# EAGLE design TheSiS (EAGLE 9.6.2)
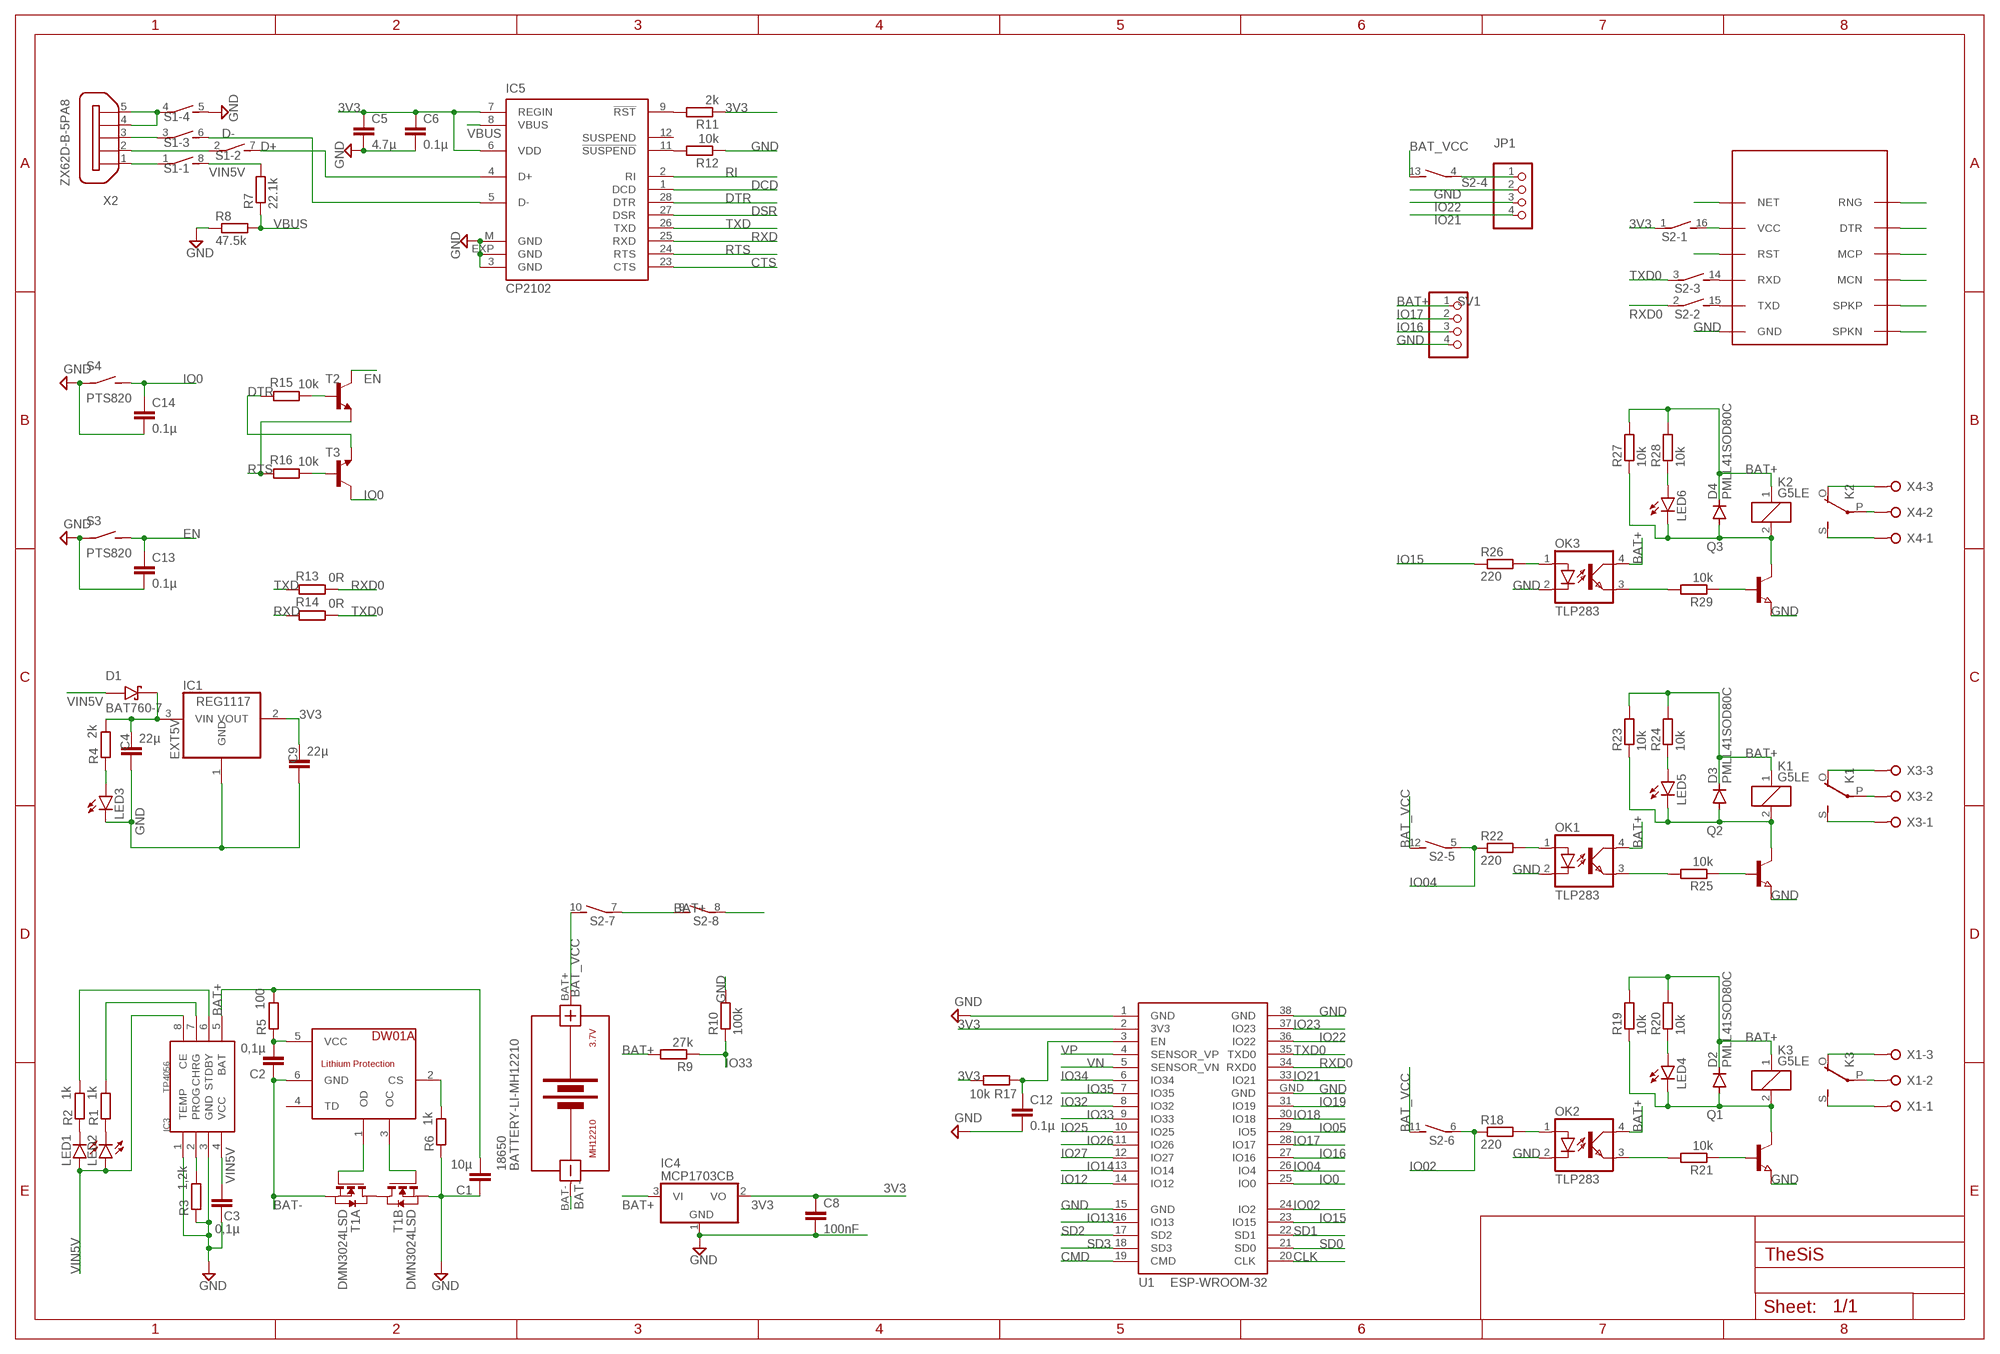
[diagram p0: schematic, sheet 1]

## Parts
18650  BATTERY-LI-MH12210  [BATTERY-LI-MH12210]
C1  10µ  C-EUC0603  [C0603]
C2  0,1µ  C-EUC0805  [C0805]
C3  0,1µ  C-EUC0805K  [C0805K]
C4  22µ  C-EUC0805  [C0805]
C5  4.7µ  C-EUC0805  [C0805]
C6  0.1µ  C-EUC0805  [C0805]
C8  100nF  C-EUC0805  [C0805]
C9  22µ  C-EUC0805  [C0805]
C12  0.1µ  C-EUC0805  [C0805]
C13  0.1µ  C-EUC0805  [C0805]
C14  0.1µ  C-EUC0805  [C0805]
D1  BAT760-7  [SOD2513X120N]
D2  PMLL41SOD80C  [SOD80C]
D3  PMLL41SOD80C  [SOD80C]
D4  PMLL41SOD80C  [SOD80C]
IC1  REG1117  [SOT223A]
IC3  TP4056  [SOP-8]
IC4  MCP1703CB  [SOT23]
IC5  CP2102  [QFN28]
JP1  PINHD-1X4  [1X04]
K1  G5LE  [G5LE]
K2  G5LE  [G5LE]
K3  G5LE  [G5LE]
LED1  LEDCHIP-LED0805  [CHIP-LED0805]
LED2  LEDCHIP-LED0805  [CHIP-LED0805]
LED3  LEDCHIP-LED0805  [CHIP-LED0805]
LED4  LEDCHIP-LED0805  [CHIP-LED0805]
LED5  LEDCHIP-LED0805  [CHIP-LED0805]
LED6  LEDCHIP-LED0805  [CHIP-LED0805]
OK1  TLP283  [SOT23-4]
OK2  TLP283  [SOT23-4]
OK3  TLP283  [SOT23-4]
Q1  NPN-TRANSISTOR_SOT23  [SOT23]
Q2  NPN-TRANSISTOR_SOT23  [SOT23]
Q3  NPN-TRANSISTOR_SOT23  [SOT23]
R1  1k  R-EU_R0603  [R0603]
R2  1k  R-EU_R0603  [R0603]
R3  1,2k  R-EU_R0603  [R0603]
R4  2k  R-EU_R0805  [R0805]
R5  100  R-EU_R0603  [R0603]
R6  1k  R-EU_R0603  [R0603]
R7  22.1k  R-EU_R0805  [R0805]
R8  47.5k  R-EU_R0805  [R0805]
R9  27k  R-EU_R0805  [R0805]
R10  100k  R-EU_R0805  [R0805]
R11  2k  R-EU_R0805  [R0805]
R12  10k  R-EU_R0805  [R0805]
R13  0R  R-EU_R0805  [R0805]
R14  0R  R-EU_R0805  [R0805]
R15  10k  R-EU_R0805  [R0805]
R16  10k  R-EU_R0805  [R0805]
R17  10k  R-EU_R0805  [R0805]
R18  220  R-EU_R0805  [R0805]
R19  10k  R-EU_R0805  [R0805]
R20  10k  R-EU_R0805  [R0805]
R21  10k  R-EU_R0805  [R0805]
R22  220  R-EU_R0805  [R0805]
R23  10k  R-EU_R0805  [R0805]
R24  10k  R-EU_R0805  [R0805]
R25  10k  R-EU_R0805  [R0805]
R26  220  R-EU_R0805  [R0805]
R27  10k  R-EU_R0805  [R0805]
R28  10k  R-EU_R0805  [R0805]
R29  10k  R-EU_R0805  [R0805]
S1  DIP04S  [DIP04S]
S2  DIP08S  [DIP08S]
S3  PTS820  [PTS820]
S4  PTS820  [PTS820]
SV1  PINHD-1X4  [1X04]
T1  DMN3024LSD  [TSSOP-8]
T2  -NPN-SOT23-EBC  [SOT23-EBC]
T3  -NPN-SOT23-EBC  [SOT23-EBC]
U1  ESP-WROOM-32  [ESP-WROOM-32]
U$1  DW01A  [SOT23-6]
U$4  SIM800L  [SIM-CORE]
X1  W237-03P  [W237-3]
X2  ZX62D-B-5PA8  [ZX62D-B-5PA8]
X3  W237-03P  [W237-3]
X4  W237-03P  [W237-3]

## Nets
3V3: C5.1 C6.1 C8.1 C9.1 IC1.2(VOUT) IC4.2(VO) IC5.6(VDD) IC5.7(REGIN) R11.1 R17.2 S2.1 U1.2(3V3)
$VCCSIM800: S2.16 U$4.VCC
BAT+: C1.2 D2.C D3.C D4.C IC3.5(BAT) IC4.3(VI) K1.1 K2.1 K3.1 OK1.4(COL) OK2.4(COL) OK3.4(COL) R5.2 R9.2 R19.2 R20.2 R23.2 R24.2 R27.2 R28.2 S2.8 SV1.1
BAT-: 18650.BAT- C2.1 T1.2(A:S) T1.3(A:S) U$1.6(GND)
BAT_VCC: 18650.BAT+ S2.10 S2.11 S2.12 S2.13
CLK: U1.20(CLK)
CMD: U1.19(CMD)
CTS: IC5.23(CTS)
D+: IC5.4(D+) S1.7
D-: IC5.5(D-) S1.6
DCD: IC5.1(DCD)
DSR: IC5.27(DSR)
DTR: IC5.28(DTR) R15.2 T3.E
EN: C13.1 S3.2(S) T2.C
EXT5V: C4.1 D1.C(K) IC1.3(VIN) R4.2
GND: C1.1 C3.1 C4.2 C5.2 C6.2 C8.2 C9.2 C12.2 C13.2 C14.2 IC1.1(GND) IC3.1(TEMP) IC3.3(GND) IC4.1(GND) IC5.3(GND) IC5.EXP(GND) IC5.M(GND) JP1.2 LED3.C OK1.2(C) OK2.2(C) OK3.2(C) Q1.2(E) Q2.2(E) Q3.2(E) R3.1 R6.1 R8.1 R10.2 R12.1 S1.5 S3.1(P) S4.1(P) SV1.4 T1.6(B:S) T1.7(B:S) U1.1(GND) U1.15(GND) U1.38(GND) U1.GND U$4.GND
IO0: C14.1 S4.2(S) T3.C U1.25(IO0)
IO02: R18.1 S2.6 U1.24(IO2)
IO04: R22.1 S2.5 U1.26(IO4)
IO05: U1.29(IO5)
IO12: U1.14(IO12)
IO13: U1.16(IO13)
IO14: U1.13(IO14)
IO15: R26.1 U1.23(IO15)
IO16: SV1.3 U1.27(IO16)
IO17: SV1.2 U1.28(IO17)
IO18: U1.30(IO18)
IO19: U1.31(IO19)
IO21: JP1.4 U1.33(IO21)
IO22: JP1.3 U1.36(IO22)
IO23: U1.37(IO23)
IO25: U1.10(IO25)
IO26: U1.11(IO26)
IO27: U1.12(IO27)
IO32: U1.8(IO32)
IO33: R9.1 R10.1 U1.9(IO33)
IO34: U1.6(IO34)
IO35: U1.7(IO35)
N$1: T1.1(A:D) T1.8(B:D)
N$2: IC3.2(PROG) R3.2
N$3: IC3.6(STDBY) R2.2
N$4: IC3.7(CHRG) R1.2
N$5: R6.2 U$1.2(CS)
N$6: LED1.C R2.1
N$7: LED2.C R1.1
N$8: T1.4(A:G) U$1.1(OD)
N$9: T1.5(B:G) U$1.3(OC)
N$10: LED3.A R4.1
N$11: C2.2 R5.1 U$1.5(VCC)
N$12: S1.1 X2.1
N$13: IC5.9(!RST) R11.2
N$14: IC5.11(!SUSPEND) R12.2
N$15: S1.4 X2.4 X2.5
N$16: S1.2 X2.2
N$17: S1.3 X2.3
N$18: R15.1 T2.B
N$19: R16.1 T3.B
N$20: C12.1 R17.1 U1.3(EN)
N$21: U$4.NET
N$22: S2.7 S2.9
N$23: U$4.RST
N$24: S2.15 U$4.TXD
N$25: S2.14 U$4.RXD
N$26: OK2.1(A) R18.2
N$27: U$4.SPKN
N$28: U$4.SPKP
N$29: U$4.RNG
N$30: U$4.DTR
N$31: U$4.MCP
N$32: U$4.MCN
N$34: OK2.3(EMIT) R21.2
N$35: JP1.1 S2.4
N$41: Q1.1(B) R21.1
N$42: OK3.1(A) R26.2
N$43: OK3.3(EMIT) R29.2
N$44: Q3.1(B) R29.1
N$45: D2.A K3.2 LED4.C Q1.3(C) R19.1
N$46: K3.O(2:O) X1.3
N$47: K3.P(2:P) X1.2
N$48: K3.S(2:S) X1.1
N$49: LED4.A R20.1
N$50: OK1.1(A) R22.2
N$51: OK1.3(EMIT) R25.2
N$52: Q2.1(B) R25.1
N$53: D3.A K1.2 LED5.C Q2.3(C) R23.1
N$54: LED5.A R24.1
N$55: K1.O(2:O) X3.3
N$56: K1.P(2:P) X3.2
N$57: K1.S(2:S) X3.1
N$58: D4.A K2.2 LED6.C Q3.3(C) R27.1
N$59: LED6.A R28.1
N$60: K2.O(2:O) X4.3
N$61: K2.P(2:P) X4.2
N$62: K2.S(2:S) X4.1
RI: IC5.2(RI)
RTS: IC5.24(RTS) R16.2 T2.E
RXD: IC5.25(RXD) R14.2
RXD0: R13.1 S2.2 U1.34(RXD0)
SD0: U1.21(SD0)
SD1: U1.22(SD1)
SD2: U1.17(SD2)
SD3: U1.18(SD3)
TXD: IC5.26(TXD) R13.2
TXD0: R14.1 S2.3 U1.35(TXD0)
VBUS: IC5.8(VBUS) R7.1 R8.2
VIN5V: C3.2 D1.A IC3.4(VCC) IC3.8(CE) LED1.A LED2.A R7.2 S1.8
VN: U1.5(SENSOR_VN)
VP: U1.4(SENSOR_VP)
Unconnected: IC5.12(SUSPEND) U$1.4(TD) X2.S1 X2.S2 X2.S3 X2.S4

## Library data of the parts
18650 = diy-modules:BATTERY-LI-MH12210: Lithium-Ion MH12210 Rechargeable Battery Panasonic NCR18650PF battery datasheet available here: https://industrial.panasonic.com/cdbs/www-data/pdf2/ACI4000/ACI4000C12.pdf Click here to find device on ebay.com <http://www.ebay.com/sch/ncr18650b+battery>
C1-C6 C8 C9 C12-C14 = rcl:C-EU: CAPACITOR, European symbol; SPICEPREFIX: C
D1 = BAT760-7:BAT760-7: Diode Schottky 30V 1A Surface Mount SOD-323 Check prices <https://pricing.snapeda.com/search/part/BAT760-7/?ref=eda>; AVAILABILITY: Good; DESCRIPTION: Diode Schottky 30V 1A Surface Mount SOD-323; MF: Diodes Inc.; MP: BAT760-7; PACKAGE: SOD-323 Diodes Inc.; PRICE: None; PURCHASE-URL: https://pricing.snapeda.com/search/part/BAT760-7/?ref=eda
D2-D4 = diode:PMLL41*: High-speed diodes Source: http://www.semiconductors.philips.com/acrobat_download/datasheets/PMLL4150_2.pdf
IC1 = REG1117:REG1117: 800mA and 1A Low Dropout (LDO) Positive Regulator 1.8V, 2.5V, 2.85V, 3.3V, 5V, and Adj; MPN: REG1117; OC_FARNELL: 1097566; OC_NEWARK: 14P6981
IC3 = TP4056:TP4056
IC4 = linear:MCP1703: 250 mA, 16V, Low Quiescent Current LDO Regulator Source: http://ww1.microchip.com/downloads/en/DeviceDoc/22049b.pdf
IC5 = CP2102:CP210*: Single-Chip USB to UART Bridge Source: www.silabs.com .. CP2101.pdf / cp2102.pdf; MF: FARNELL; MPN: CP2102-GM; OC_FARNELL: 9282130; OC_NEWARK: 30K5635
JP1 SV1 = pinhead:PINHD-1X4: PIN HEADER
K1-K3 = G5LE_1:G5LE: RELAY 1 x switch, 10 A/120 V AC, 8 A/30 V DC, Omron
LED1-LED6 = led:LED: LED OSRAM: - CHIPLED LG R971, LG N971, LY N971, LG Q971, LY Q971, LO R971, LY R971 LH N974, LH R974 LS Q976, LO Q976, LY Q976 LO Q996 - Hyper CHIPLED LW Q18S LB Q993, LB Q99A, LB R99A - SideLED LS A670, LO A670, LY A670, LG A670, LP A670 LB A673, LV A673, LT A673, LW A673 LH A674 LY A675 LS A676, LA A676, LO A676, LY A676, LW A676 LS A679, LY A679, LG A679 - Hyper Micro SIDELED® LS Y876, LA Y876, LO Y876, LY Y876 LT Y87S - SmartLED LW L88C, LW L88S LB L89C, LB L89S, LG L890 LS L89K, LO L89K, LY L89K LS L896, LA L896, LO L896, LY L896 - TOPLED LS T670, LO T670, LY T670, LG T670, LP T670 LSG T670, LSP T670, LSY T670, LOP T670, LYG T670 LG T671, LOG T671, LSG T671 LB T673, LV T673, LT T673, LW T673 LH T674 LS T676, LA T676, LO T676, LY T676, LB T676, LH T676, LSB T676, LW T676 LB T67C, LV T67C, LT T67C, LS T67K, LO T67K, LY T67K, LW E67C LS E67B, LA E67B, LO E67B, LY E67B, LB E67C, LV E67C, LT E67C LW T67C LS T679, LY T679, LG T679 LS T770, LO T770, LY T770, LG T770, LP T770 LB T773, LV T773, LT T773, LW T773 LH T774 LS E675, LA E675, LY E675, LS T675 LS T776, LA T776, LO T776, LY T776, LB T776 LHGB T686 LT T68C, LB T68C - Hyper Mini TOPLED® LB M676 - Mini TOPLED Santana® LG M470 LS M47K, LO M47K, LY M47K Source: http://www.osram.convergy.de LUXEON: - LUMILED® LXK2-PW12-R00, LXK2-PW12-S00, LXK2-PW14-U00, LXK2-PW14-V00 LXK2-PM12-R00, LXK2-PM12-S00, LXK2-PM14-U00 LXK2-PE12-Q00, LXK2-PE12-R00, LXK2-PE12-S00, LXK2-PE14-T00, LXK2-PE14-U00 LXK2-PB12-K00, LXK2-PB12-L00, LXK2-PB12-M00, LXK2-PB14-N00, LXK2-PB14-P00, LXK2-PB14-Q00 LXK2-PR12-L00, LXK2-PR12-M00, LXK2-PR14-Q00, LXK2-PR14-R00 LXK2-PD12-Q00, LXK2-PD12-R00, LXK2-PD12-S00 LXK2-PH12-R00, LXK2-PH12-S00 LXK2-PL12-P00, LXK2-PL12-Q00, LXK2-PL12-R00 Source: www.luxeon.com KINGBRIGHT: KA-3528ASYC Source: www.kingbright.com
OK1-OK3 = tlp283:TLP283: TOSHIBA PHOTOCOUPLER GaAs IRED & PHOTO-TRANSISTOR Source: http://www.semicon.toshiba.co.jp/td/en/Opto/Photocoupler/en_20050928_TLP283_datasheet.pdf; OC_FARNELL: unknown; OC_NEWARK: unknown
Q1-Q3 = semicon-smd-ipc:NPN-TRANSISTOR_: NPN TRANSISTOR
R1-R29 = rcl:R-EU_: RESISTOR, European symbol; SPICEPREFIX: R
S1 = switch-dil:DIP04S: DIL/CODE SWITCH; OC_FARNELL: unknown; OC_NEWARK: unknown
S2 = switch-dil:DIP08S: DIL/CODE SWITCH; OC_FARNELL: unknown; OC_NEWARK: unknown
S3 S4 = switch-ck:PTS820: C&K Components PTS820 Series Microminiature SMT Top Actuated
T1 = FS8205A:DMN3024LSD: DUAL N-CHANNEL ENHANCEMENT MODE MOSFET data sheet <http://goo.gl/dRgboR> Dave.Calaway Eagle Library <https://goo.gl/Muy1Tr>
T2 T3 = transistor:*-NPN-: NPN Transistror BF959 corrected 2008.03.06; SPICEPREFIX: J
U1 = esp32:ESP-WROOM-32: Espressif Systems ESP-WROOM-32
U$1 = DW01A:DW01A
U$4 = sim800l:SIM800L
X1 X3 X4 = Terminal_Block_5mm.:W237-03P: WAGO SREW CLAMP; OC_FARNELL: unknown; OC_NEWARK: unknown
X2 = zx62d-b-5pa8-oshpark_10:ZX62D-B-5PA8: Micro USB Type B Connector - Standard, Shell Through Hole Source: http://www.hirose.co.jp/cataloge_hp/ed_ZX_20140804.pdf; MF: Hirose; MPN: ZX62D-B-5PA8; OC_FARNELL: 2300438; OC_NEWARK: 69W0712

## Board
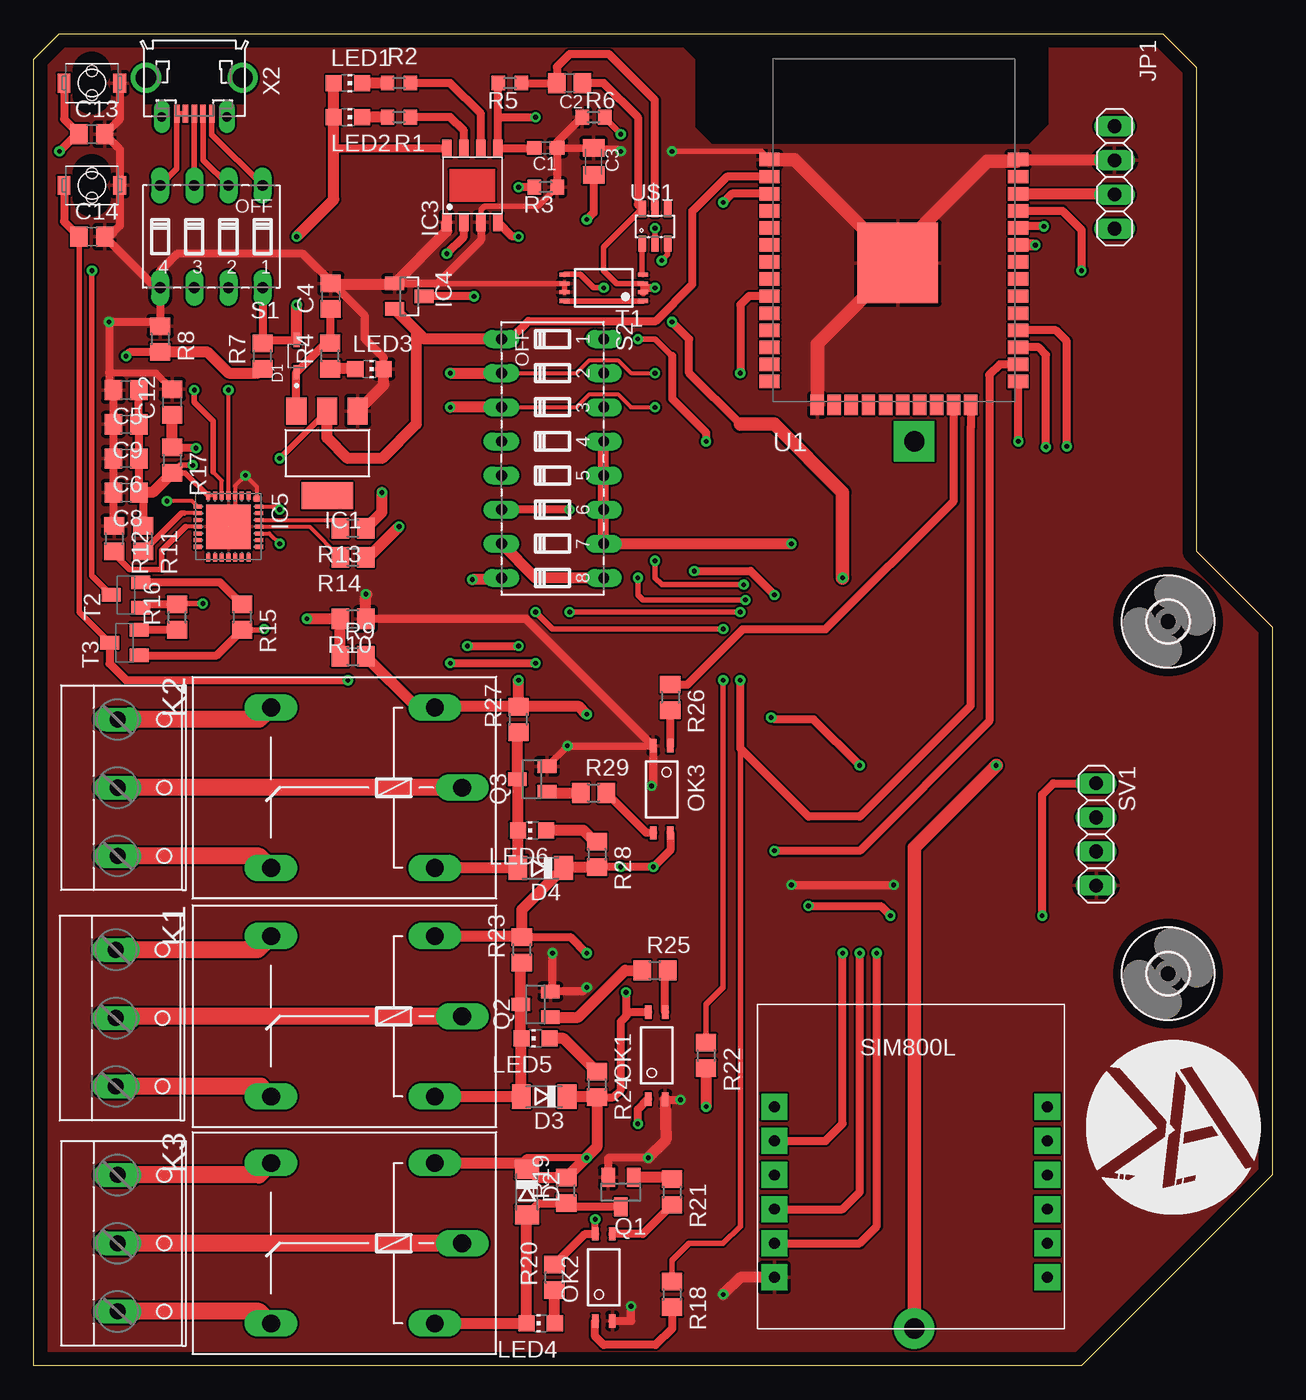
[diagram p1: board, top side]
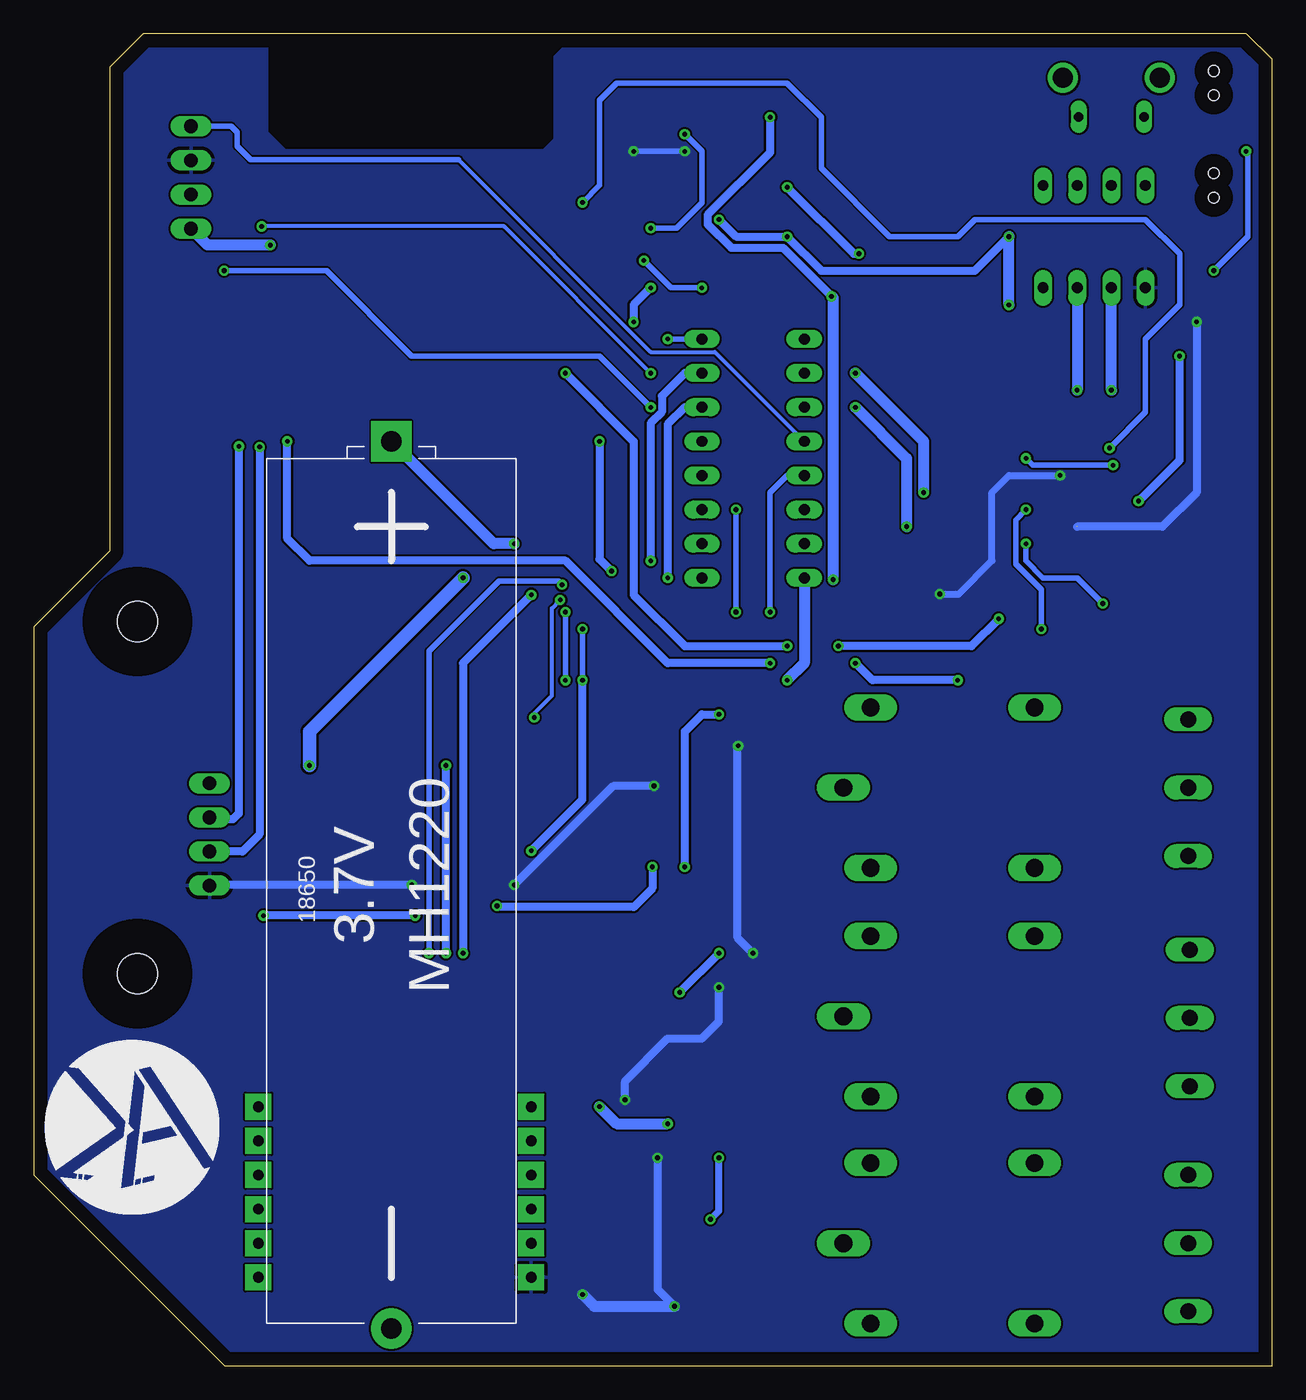
[diagram p2: board, bottom side, seen from below]

Size 92.19 x 99.17 mm. Coordinates in mm from the lower left corner, seen from the top.
Outline: 0,0 0,97.27 1.91,99.17 84.05,99.17 86.54,96.69 86.54,60.64 92.19,54.99 92.19,14.21 77.98,0 0,0
Copper layers (1*16): Top 0.035mm / dielectric 1.5mm / Bottom 0.035mm
Design rules "default": minimum track width 6mil, minimum drill 0.35mm, track to track 6mil, track to pad 6mil, pad to pad 6mil, via to via 6mil, smd to smd 6mil, copper to edge 40mil, drill to drill 6mil, minimum pad ring 10mil, minimum via ring 8mil, stop-mask expansion 4mil, vias tented up to drill 0mil, thermal gap 10mil

### Footprints (pad centres in the part's own frame; a part is rotated, then mirrored left to right if it is on the bottom)
BATTERY-LI-MH12210 = drill 1.5 pad 3 square: BAT+ -33.02,0 | drill 1.5 pad 3: BAT- 33.02,0
C0603 = smd 1.1 x 1: 1 -0.85,0; 2 0.85,0
C0805 = smd 1.3 x 1.5: 1 -0.95,0; 2 0.95,0
C0805K = smd 1.3 x 1.6: 1 -1,0; 2 1,0
SOD2513X120N = smd 1.04 x 0.46: A 1.19,0; C -1.19,0
SOD80C = smd 1.4 x 1.8: A 1.7,0; C -1.7,0
SOT223A = smd 1.499 x 2.007: 1 -2.261,-3.15; 2 0.025,-3.15; 3 2.311,-3.15 | smd 3.81 x 2.007: 4 0,3.15
SOP-8 = smd 1.3 x 0.7: 1 -2.75,1.905; 2 -2.75,0.635; 3 -2.75,-0.635; 4 -2.75,-1.905; 5 2.75,-1.905; 6 2.75,-0.635; 7 2.75,0.635; 8 2.75,1.905
SOT23 = smd 1 x 1.4: 1 -0.95,-1.1; 2 0.95,-1.1; 3 0,1.1
QFN28 = smd 0.6 x 0.3: 1 -2.3,1.5; 2 -2.3,1; 3 -2.3,0.5; 4 -2.3,0; 5 -2.3,-0.5; 6 -2.3,-1; 7 -2.3,-1.5; 15 2.3,-1.5; 16 2.3,-1; 17 2.3,-0.5; 18 2.3,0; 19 2.3,0.5; 20 2.3,1; 21 2.3,1.5 | smd 0.3 x 0.6: 8 -1.5,-2.3; 9 -1,-2.3; 10 -0.5,-2.3; 11 0,-2.3; 12 0.5,-2.3; 13 1,-2.3; 14 1.5,-2.3; 22 1.5,2.3; 23 1,2.3; 24 0.5,2.3; 25 0,2.3; 26 -0.5,2.3; 27 -1,2.3; 28 -1.5,2.3 | smd 3.3 x 3.3: EXP 0,0 | smd 0.435 x 0.435: M -2.103,2.103
1X04 = drill 1.016 long: 1 -3.81,0; 2 -1.27,0; 3 1.27,0; 4 3.81,0
G5LE = drill 1.321 long: 1 -7.493,-5.969; 2 -7.493,5.969; O 4.699,5.969; P -9.525,0; S 4.699,-5.969
CHIP-LED0805 = smd 1.2 x 1.2: A 0,-1.05; C 0,1.05
SOT23-4 = smd 1 x 0.5: 1 -3.24,0.635; 2 -3.24,-0.635; 3 3.24,-0.635; 4 3.24,0.635
R0603 = smd 1 x 1.1: 1 -0.85,0; 2 0.85,0
R0805 = smd 1.3 x 1.5: 1 -0.95,0; 2 0.95,0
DIP04S = drill 0.813 long: 1 -3.81,-3.81; 2 -1.27,-3.81; 3 1.27,-3.81; 4 3.81,-3.81; 5 3.81,3.81; 6 1.27,3.81; 7 -1.27,3.81; 8 -3.81,3.81
DIP08S = drill 0.813 long: 1 -8.89,-3.81; 2 -6.35,-3.81; 3 -3.81,-3.81; 4 -1.27,-3.81; 5 1.27,-3.81; 6 3.81,-3.81; 7 6.35,-3.81; 8 8.89,-3.81; 9 8.89,3.81; 10 6.35,3.81; 11 3.81,3.81; 12 1.27,3.81; 13 -1.27,3.81; 14 -3.81,3.81; 15 -6.35,3.81; 16 -8.89,3.81
PTS820 = smd 0.95 x 1.4: 1 -2.075,0; 2 2.075,0 | hole 0.8: 0,0.9; 0,-0.9
TSSOP-8 = smd 0.3 x 0.75: 1 -0.975,-2.925; 2 -0.325,-2.925; 3 0.325,-2.925; 4 0.975,-2.925; 5 0.975,2.925; 6 0.325,2.925; 7 -0.325,2.925; 8 -0.975,2.925
SOT23-EBC = smd 1 x 1.4: B 0.95,-1.1; C 0,1.1; E -0.95,-1.1
ESP-WROOM-32 = smd 1.5 x 1: 1 -9.25,7; 2 -9.25,5.73; 3 -9.25,4.46; 4 -9.25,3.19; 5 -9.25,1.92; 6 -9.25,0.65; 7 -9.25,-0.62; 8 -9.25,-1.89; 9 -9.25,-3.16; 10 -9.25,-4.43; 11 -9.25,-5.7; 12 -9.25,-6.97; 13 -9.25,-8.24; 14 -9.25,-9.51; 25 9.25,-9.51; 26 9.25,-8.24; 27 9.25,-6.97; 28 9.25,-5.7; 29 9.25,-4.43; 30 9.25,-3.16; 31 9.25,-1.89; 32 9.25,-0.62; 33 9.25,0.65; 34 9.25,1.92; 35 9.25,3.19; 36 9.25,4.46; 37 9.25,5.73; 38 9.25,7 | smd 1 x 1.5: 15 -5.7,-11.25; 16 -4.43,-11.25; 17 -3.16,-11.25; 18 -1.89,-11.25; 19 -0.62,-11.25; 20 0.65,-11.25; 21 1.92,-11.25; 22 3.19,-11.25; 23 4.46,-11.25; 24 5.73,-11.25 | smd 6 x 6: GND 0.3,-0.7
SOT23-6 = smd 0.55 x 1.2: 1 -0.95,-1.3; 2 0,-1.3; 3 0.95,-1.3; 4 0.95,1.3; 5 0,1.3; 6 -0.95,1.3
3,0 = hole 3: 0,0
SIM-CORE = drill 0.8 pad 1.93 square: DTR 21.59,13.97; GND 1.27,3.81; MCN 21.59,8.89; MCP 21.59,11.43; NET 1.27,16.51; RNG 21.59,16.51; RST 1.27,11.43; RXD 1.27,8.89; SPKN 21.59,3.81; SPKP 21.59,6.35; TXD 1.27,6.35; VCC 1.27,13.97
W237-3 = drill 1.194 long: 1 -5.08,-0.635; 2 0,-0.635; 3 5.08,-0.635
ZX62D-B-5PA8 = smd 1.35 x 0.4: 1 4.825,1.3; 2 4.825,0.65; 3 4.825,0; 4 4.825,-0.65; 5 4.825,-1.3 | drill 1.5: S1 2.15,-3.6; S2 2.15,3.6 | drill 0.7 long: S3 5.05,2.425; S4 5.05,-2.425

### Placement (x,y rotation side)
18650  65.56,35.8 270 bottom
C1  38.13,90.67 180 top
C2  39.9,95.49 180 top
C3  41.68,89.65 270 top
C4  22.12,79.62 90 top
C5  6.88,72.63 180 top
C6  6.88,67.55 180 top
C8  6.88,65.01 180 top
C9  6.88,70.09 180 top
C12  10.31,71.74 90 top
C13  4.34,91.68 0 top
C14  4.34,84.06 0 top
D1  19.58,75.17 90 top
D2  36.73,12.94 270 top
D3  38,20.05 180 top
D4  37.74,37.07 180 top
IC1  21.87,67.93 180 top
IC3  32.66,87.87 90 top
IC4  27.97,79.62 270 top
IC5  14.5,62.47 270 top
JP1  80.47,88.47 270 top
K1  22.38,26.02 180 top
K2  22.38,43.04 180 top
K3  22.38,9.13 180 top
LED1  23.39,95.49 270 top
LED2  23.39,92.95 270 top
LED3  25.01,74.21 270 top
LED4  37.74,3.16 90 top
LED5  37.36,24.37 90 top
LED6  37.11,39.87 90 top
OK1  46.38,23.1 90 top
OK2  42.44,6.59 90 top
OK3  46.76,42.91 270 top
Q1  43.71,12.94 180 top
Q2  37.36,26.91 90 top
Q3  37.11,43.68 90 top
R1  27.2,92.95 0 top
R2  27.2,95.49 0 top
R3  38.13,87.74 180 top
R4  22.09,75.18 90 top
R5  35.46,95.49 180 top
R6  41.68,92.95 0 top
R7  17.04,75.17 90 top
R8  9.42,76.44 270 top
R9  23.77,52.82 0 top
R10  23.77,55.61 0 top
R11  8.15,61.58 270 top
R12  5.99,61.58 270 top
R13  23.77,62.34 180 top
R14  23.77,60.19 180 top
R15  15.52,55.74 270 top
R16  10.69,55.74 90 top
R17  10.31,67.42 270 top
R18  47.52,5.32 270 top
R19  39.65,13.07 90 top
R20  38.76,6.59 90 top
R21  47.52,12.94 270 top
R22  50.06,23.1 270 top
R23  36.35,30.98 90 top
R24  41.94,20.94 270 top
R25  46.25,29.45 0 top
R26  47.4,49.77 270 top
R27  36.09,48.12 90 top
R28  41.94,38.09 270 top
R29  41.68,42.66 0 top
S1  13.23,84.06 180 top
S2  38.63,67.55 270 top
S3  4.34,95.49 180 top
S4  4.34,87.87 180 top
SV1  79.1,39.56 270 top
T1  42.44,80.25 90 top
T2  6.88,57.39 90 top
T3  6.76,53.84 90 top
U1  64.03,82.79 0 top
U$1  46.25,84.82 0 top
U$2  [3,0]  84.45,55.41 0 top
U$3  [3,0]  84.45,29.2 0 top
U$4  53.87,2.78 0 top
X1  6.88,9.13 270 top
X2  11.96,98.03 270 top
X3  6.76,25.9 270 top
X4  6.88,43.04 270 top

### Tracks (layer width: path | path; a pad name or v marks a point on that pad's centre or on a via)
3V3  (via drill 0.35)
  Top 0.305: IC5.6 IC5.7
  Top 0.406: IC5.7 11.3,66.47 R17.2 10.88,67.04 v11.84,67.04 | v18.31,67.55 IC1.2
  Top 0.61: C5.1 C9.1 C6.1 C8.1 8.15,64.69 R11.1 | U1.2 51.6,88.52 49.05,85.97 49.05,80.51 46.32,77.78 36.83,77.78 35.48,76.44 S2.1
  Top 0.813: R17.2 8.85,65.01 C8.1 | IC1.2 21.84,69.1 23.39,67.55 25.93,67.55 28.47,70.09 28.47,77.06 IC4.2 29.09,76.44 S2.1
  Bottom 0.406: v11.84,67.04 17.8,67.04 v18.31,67.55
$VCCSIM800  (via drill 0.35)
  Top 0.406: v44.98,76.44 46.25,76.44 47.52,75.17
  Top 0.61: v50.06,68.82 50.06,69.46 47.52,72 47.52,75.17 | U$4.VCC 58.95,16.75 60.22,18.02 v60.22,30.72 | v49.17,59.17 53.36,59.17 v55.14,57.39
  Bottom 0.406: S2.16 v44.98,76.44
  Bottom 0.61: v50.06,68.82 50.06,60.06 v49.17,59.17 | v55.14,57.39 60.22,52.31 v60.22,30.72
BAT+  (via drill 0.35)
  Top 0.508: OK2.4 v41.81,10.91 | v41.17,15.48 36.65,15.48 36.27,15.1
  Top 0.61: R20.2 41.05,9.83 OK2.4 | R24.2 43.14,19.99 43.71,20.56 43.71,25.64 44.09,26.02 | 44.09,26.02 44.41,26.34 OK1.4 | R23.2 39.97,31.93 v41.17,30.72 | v44.09,27.8 44.09,26.02 | R28.2 v43.71,37.14 v46.13,37.14 47.4,38.4 OK3.4 | 34.57,92.95 IC3.5 37.23,90.62 C1.2 | 34.57,92.95 34.57,95.45 R5.2 | 34.57,92.95 v37.36,92.95 | v32.79,79.62 IC4.3 | v57.68,34.24 63.06,34.24 v63.78,33.52 | v75.08,33.52 75.08,42.55 75.91,43.37 SV1.1
  Top 0.813: K3.1 36.27,15.1 D2.C 36.93,14.64 37.56,14.02 R19.2 41.94,16.3 R24.2 41.87,20.05 D3.C | K1.1 36.28,31.99 R23.2 36.35,33.97 D4.C 39.51,37.14 R28.2 | R27.2 29.93,49.07 K2.1 28.53,49.01 R9.2 | v41.17,48.5 40.6,49.07 R27.2 | R27.2 v36.09,51.04 | S2.8 34.7,58.53 v32.66,58.53
  Bottom 0.508: v41.81,10.91 41.17,11.54 v41.17,15.48
  Bottom 0.61: v41.17,30.72 v44.09,27.8 | v43.71,37.14 43.71,47.23 42.44,48.5 v41.17,48.5 | v32.79,79.62 36.4,83.23 40.25,83.23 42.01,84.99 42.01,85.68 37.36,90.32 v37.36,92.95 | v46.13,37.14 46.13,35.55 47.51,34.16 57.68,34.16 v57.68,34.24 | v63.78,33.52 v75.08,33.52
  Bottom 0.813: S2.8 34.82,52.31 v36.09,51.04 | v32.66,58.53 32.66,79.49 v32.79,79.62
BAT-  (via drill 0.35)
  Top 0.406: T1.2 T1.3 43.39,80.58 42.44,81.52 42.44,83.26 U$1.6
  Top 0.61: C2.1 42.44,95.49 44.98,92.95 44.98,86.44 U$1.6 | T1.2 45.69,80.25 v46.25,80.25 | 52.6,70.09 48.79,73.9 48.79,76.44 v47.52,77.71
  Top 1.016: v71.65,44.69 65.56,38.6 18650.BAT- | v60.22,58.66 60.22,65.01 55.14,70.09 52.6,70.09
  Bottom 0.61: v46.25,80.25 47.52,78.98 v47.52,77.71
  Bottom 1.016: v60.22,58.66 71.65,47.23 v71.65,44.69
BAT_VCC  (via drill 0.35)
  Top 0.813: S2.13 S2.12 S2.11 S2.10 v56.41,61.2
  Bottom 0.813: 18650.BAT+ 57.94,61.2 v56.41,61.2
D+  (via drill 0.35)
  Top 0.305: IC5.4 v14.5,72.63
  Bottom 0.813: S1.7 v14.5,72.63
D-  (via drill 0.35)
  Top 0.305: IC5.5 14,65.89 13.36,66.54
  Top 0.406: 13.36,66.54 13.36,70.35 11.96,71.74 v11.96,72.63
  Bottom 0.813: v11.96,72.63 S1.6
DTR  (via drill 0.35)
  Top 0.305: IC5.28 18.08,63.97 v18.31,63.74
  Top 0.406: R15.2 17.11,54.79 v17.17,54.85
  Top 0.61: T3.E 13.61,52.89 R15.2
  Bottom 0.406: v17.17,54.85 17.17,57.77 19.08,59.68 19.08,62.98 v18.31,63.74
EN  (via drill 0.35)
  Top 0.406: T2.C 4.34,58.83 v4.34,81.52
  Top 0.61: S3.2 2.27,92.81 C13.1 3.2,91.68 v1.93,90.41
  Bottom 0.406: v4.34,81.52 1.8,84.06 1.8,90.41 v1.93,90.41
EXT5V
  Top 0.61: IC1.3 19.56,73.96 D1.C 21.74,76.13 R4.2 22.12,76.17 C4.1
GND  (via drill 0.35)  (1 unrouted)
  Top 0.305: IC5.M 16.61,65.45 v15.77,66.28 15,65.51 IC5.3 15,62.97
  Top 0.406: 15,62.97 IC5.EXP | T1.7 T1.6 30.07,80.58 | R3.1 37.55,86.32 33.55,86.32 33.3,86.06 IC3.3 | C3.1 43.47,90.65 v43.71,90.41 | v47.52,90.41 54.16,90.41 U1.1
  Top 0.508: Q3.2 v39.74,46.15 OK3.2 | C12.2 9.1,73.9 5.61,73.9
  Top 0.61: OK2.2 44.47,3.35 v44.47,4.43 | v45.75,15.48 42.76,15.48 Q1.2 | OK1.2 47.08,19.8 v48.16,19.8 | v41.17,28.18 40.85,27.86 Q2.2 38.63,28.03 v38.63,30.72 | S1.5 R8.1 9.1,77.71 v5.61,77.71 5.61,73.9 5.61,72.95 C5.2 C9.2 C6.2 C8.2 5.93,62.59 R12.1 | S3.1 6.42,92.81 C13.2 6.42,90.56 S4.1 6.42,84.87 5.61,84.06 C14.2 9.1,80.25 S1.5 | S1.5 9.42,81.52 10.69,82.79 20.05,82.79 22.35,80.48 24.66,78.17 24.66,76.44 26.06,75.05 LED3.C | R10.2 36.67,55.61 OK3.2 46.13,43.29 v46,43.17 | IC3.3 33.3,83.81 30.07,80.58 26.88,80.58 | C1.1 C3.1 | C1.1 R3.1 | C1.1 38.97,91.1 R6.1 | v56.41,35.8 v64.03,35.8
  Top 0.813: OK1.2 47.07,16.81 v45.75,15.48 | C4.2 22.27,80.57 22.35,80.48 26.78,80.48 IC4.1 26.88,80.58 30.76,84.46 IC3.1 | U$4.GND 52.6,6.59 v51.33,5.32 | R10.2 24.72,57.33 24.79,57.39 v24.73,57.45 | IC1.1 26.06,73.01 LED3.C | U1.38 80.41,89.79 JP1.2
  Top 1.016: U1.15 58.33,76.09 U1.GND | U1.38 73.17,89.68 70.99,89.68 64.33,83.03 U1.GND | U1.1 56.63,89.79 U1.GND
  Bottom 0.406: v43.71,90.41 v47.52,90.41
  Bottom 0.508: v24.73,57.45 23.33,57.45 20.85,59.93 20.85,65.01 19.58,66.28 v15.77,66.28
  Bottom 0.61: v45.75,15.48 45.75,5.7 v44.47,4.43 | v48.16,19.8 48.16,21.2 44.98,24.37 42.44,24.37 41.17,25.64 v41.17,28.18 | v38.63,30.72 39.78,31.86 39.78,46.22 39.74,46.18 v39.74,46.15 | v5.61,77.71 5.61,65.01 8.15,62.47 IC5.EXP | v46,43.17 49.05,43.17 v56.41,35.8 | v64.03,35.8 79.05,35.8 SV1.4
  Bottom 0.813: v51.33,5.32 50.44,4.43 v44.47,4.43
  pour Top: 0.01,0.06 0.01,98.55 0.88,99.42 0.98,99.42 47.04,99.42 49.2,97.26 49.2,92.2 50.24,91.16 50.44,90.96 50.47,90.96 74.17,90.96 75.63,92.42 75.63,99.17 75.87,99.42 83.32,99.42 83.35,99.39 86.58,96.16 86.58,96.11 86.58,60.6 92.21,54.97 92.21,11.56 89.56,11.56 77.98,-0.03 0.1,-0.03
  pour Bottom: 0,0 0,97.27 0.36,97.62 0.56,97.83 1.91,99.17 8.78,99.17 51.75,99.17 53.49,97.43 53.49,91.31 54.28,90.53 73.43,90.53 74.74,91.83 74.74,98.11 75.81,99.17 84.05,99.17 86.54,96.69 86.54,60.64 92.19,54.99 92.19,14.21 77.98,0
IO0  (via drill 0.35)
  Top 0.406: T3.C 3.39,56.1 C14.1
  Top 0.61: S4.2 2.27,85.19 C14.1 | T3.C 5.66,52.27 6.88,51.04 v23.39,51.04 | v31.01,52.31 v37.36,52.31 | U1.25 73.28,68.84 v73.3,68.82
  Bottom 0.61: v31.01,52.31 29.74,51.04 v23.39,51.04 | v37.36,52.31 44.98,52.31 52.6,59.93 71.65,59.93 73.3,61.58 v73.3,68.82
IO02  (via drill 0.35)
  Top 0.406: R18.1 47.52,7.86 48.79,9.13 51.33,9.13 52.6,10.4 v52.6,51.04 | v52.6,56.12 v39.9,56.12
  Top 0.61: U1.24 69.76,69.85 69.75,69.84 69.75,49.14 61.49,40.88 57.68,40.88 52.6,45.96 v52.6,51.04 | v39.9,63.74 S2.6
  Bottom 0.406: v52.6,51.04 v52.6,56.12 | v39.9,56.12 v39.9,63.74
IO04  (via drill 0.35)
  Top 0.406: R22.1 50.06,26.91 51.33,28.18 v51.33,51.04 | v51.33,54.85 38.63,54.85 v37.36,56.12
  Top 0.61: U1.26 71.92,74.55 71.14,73.77 71.14,47.99 61.49,38.34 v55.14,38.34
  Bottom 0.406: v51.33,51.04 v51.33,54.85 | v37.36,56.12 37.36,65.01 36.09,66.28 S2.5
  Bottom 0.61: v55.14,38.34 51.33,42.15 v51.33,51.04
IO15
  Top 0.61: R26.1 48.67,50.72 52.8,54.85 58.95,54.85 68.49,64.39 U1.23
IO16  (via drill 0.35)
  Top 0.61: v75.36,68.4 75.36,75.27 74.81,75.82 U1.27
  Bottom 0.61: SV1.3 76.64,38.29 75.36,39.57 v75.36,68.4
IO17  (via drill 0.35)
  Top 0.61: v76.91,68.45 76.91,76.26 76.08,77.09 U1.28
  Bottom 0.61: SV1.2 78.94,40.68 77.36,40.68 76.91,41.12 v76.91,68.45
IO21  (via drill 0.35)
  Top 0.813: v74.57,83.43 74.55,83.44 U1.33
  Bottom 0.813: v74.57,83.43 79.23,83.43 JP1.4
IO22
  Top 0.813: U1.36 80.41,87.25 JP1.3
IO33  (via drill 0.35)
  Top 0.61: v32.28,53.58 v36.09,53.58 | U1.9 53.25,79.63 52.6,78.98 v52.6,73.9
  Top 0.813: R9.1 R10.1 v20.34,55.61
  Bottom 0.61: v20.34,55.61 22.38,53.58 v32.28,53.58 | v52.6,73.9 47.52,68.82 47.52,57.39 43.71,53.58 v36.09,53.58
N$1
  Top 0.406: T1.1 T1.8
N$2  (via drill 0.35)
  Top 0.61: R3.2 v36.09,87.74 | v30.76,82.79 32.03,84.06 IC3.2
  Bottom 0.61: v36.09,87.74 31.14,82.79 v30.76,82.79
N$3
  Top 0.61: IC3.6 33.3,93.21 31.01,95.49 R2.2
N$4
  Top 0.61: IC3.7 32.03,91.94 31.01,92.95 R1.2
N$5  (via drill 0.35)
  Top 0.406: U$1.2 v46.25,84.7 | v43.71,91.68 42.53,92.86 R6.2
  Bottom 0.406: v46.25,84.7 44.35,84.7 42.44,86.6 42.44,90.41 v43.71,91.68
N$6
  Top 0.813: R2.1 LED1.C
N$7
  Top 0.813: R1.1 LED2.C
N$8
  Top 0.406: U$1.1 45.3,81.29 T1.4
N$9  (via drill 0.35)
  Top 0.406: v46.76,82.28 47.2,82.73 U$1.3 | v42.44,80.25 41.68,80.25 40.67,81.27 39.56,81.27 T1.5
  Bottom 0.406: v46.76,82.28 44.73,80.25 v42.44,80.25
N$10
  Top 0.813: LED3.A 23.93,74.23 R4.1
N$11
  Top 0.61: R5.1 C2.2 38.95,96.7 39.9,97.65 42.82,97.65 46.25,94.22 U$1.5
N$12
  Top 0.406: X2.1 13.26,91.65 S1.1
N$13
  Top 0.305: IC5.9 11.22,63.47
  Top 0.406: 11.22,63.47 11.2,63.49 11.01,63.49 9.05,61.53 R11.2
N$14
  Top 0.305: IC5.11 11.33,62.47
  Top 0.406: R12.2 5.99,60.44 7.14,59.3 9.55,59.3 9.55,60.69 11.33,62.47
N$15
  Top 0.406: S1.4 10.66,89.11 X2.5 X2.4
N$16
  Top 0.406: X2.2 12.61,89.76 S1.2
N$17
  Top 0.406: X2.3 S1.3
N$18
  Top 0.61: T2.B 13.87,58.34 R15.1
N$19
  Top 0.61: R16.1 T3.B
N$20  (via drill 0.35)
  Top 0.61: R17.1 12.03,68.37 v12.09,68.31 | U1.3 51.98,87.25 v51.33,86.6
  Top 0.813: R17.1 C12.1
  Bottom 0.406: v12.09,68.31 9.42,70.98 9.42,76.44 6.88,78.98 6.88,82.79 9.42,85.33 22.12,85.33 23.39,84.06 28.47,84.06 33.55,89.14 33.55,92.95 36.09,95.49 48.79,95.49 50.06,94.22 50.06,87.87 v51.33,86.6
N$22
  Top 0.813: S2.9 37.36,58.66 S2.7
N$24  (via drill 0.35)
  Top 0.406: v46.25,59.93 46.25,58.66 46.76,58.15 v52.86,58.15
  Top 0.61: U$4.TXD 61.49,9.13 62.76,10.4 v62.76,30.72
  Bottom 0.406: v52.86,58.15 53.11,58.41 57.56,58.41 62.76,53.2 v62.76,30.72
  Bottom 0.61: S2.15 43.71,73.9 45.42,72.2 45.42,71.02 46.25,70.18 v46.25,59.93
N$25  (via drill 0.35)
  Top 0.406: v52.99,57.02 45.36,57.02 44.98,57.39 v44.98,58.66
  Top 0.61: U$4.RXD 60.22,11.67 61.49,12.94 v61.49,30.72 | v61.49,44.69 58.06,48.12 55.16,48.12 54.96,48.32 v54.91,48.27
  Bottom 0.305: v54.91,48.27 54.91,48.59 53.61,49.9 53.61,56.39 52.98,57.01 v52.99,57.02
  Bottom 0.61: S2.14 43.71,71.36 44.98,70.09 v44.98,58.66 | v61.49,30.72 v61.49,44.69
N$26
  Top 0.61: R18.2 47.52,2.78 46.3,1.56 42.44,1.56 41.81,2.2 OK2.1
N$34
  Top 0.61: R21.2 45.36,9.83 OK2.3
N$35
  Bottom 0.305: S2.4 41.48,75.48 46.25,75.48 60.55,89.78
  Bottom 0.406: 60.55,89.78 76.05,89.78 77.05,90.78 77.05,91.83 77.5,92.28 JP1.1
N$41
  Top 0.813: R21.1 47.37,14.04 Q1.1
N$42
  Top 0.61: OK3.1 R26.2
N$43
  Top 0.61: R29.2 45.62,39.67 OK3.3
N$44
  Top 0.813: Q3.1 38.28,42.66 R29.1
N$45
  Top 0.61: D2.A 37.61,12.12 R19.1 39.93,11.84 Q1.3
  Top 0.813: K3.2 LED4.C 36.69,11.21 D2.A
N$46
  Top 1.27: K3.O 16.79,4.05 X1.3
N$47
  Top 1.27: K3.P X1.2
N$48
  Top 1.27: K3.S 16.79,14.21 X1.1
N$49
  Top 0.813: LED4.A 38.79,5.61 R20.1
N$50  (via drill 0.35)
  Top 0.61: v44.98,18.02 44.98,19.1 OK1.1
  Top 0.813: R22.2 v50.06,19.29
  Bottom 0.813: v50.06,19.29 48.79,18.02 v44.98,18.02
N$51
  Top 0.61: OK1.3 47.02,29.26 R25.2
N$52
  Top 0.813: Q2.1 40.54,25.96 44.03,29.45 R25.1
N$53
  Top 0.813: R23.1 36.26,29.94 Q2.3 36.26,24.42 LED5.C 36.3,24.36 D3.A K1.2
N$54
  Top 0.813: R24.1 39.46,24.37 LED5.A
N$55
  Top 1.27: K1.O 16.92,20.82 X3.3
N$56
  Top 1.27: K1.P 6.25,26.02 X3.2
N$57
  Top 1.27: K1.S 16.66,30.98 X3.1
N$58
  Top 0.813: K2.2 D4.A 36.06,37.09 LED6.C 36.06,43.63 Q3.3 36.01,47.09 R27.1
N$59
  Top 0.813: R28.1 41.75,39.04 40.92,39.87 LED6.A
N$60
  Top 1.27: K2.O 16.79,37.96 X4.3
N$61
  Top 1.27: K2.P X4.2
N$62
  Top 1.27: K2.S 16.79,48.12 X4.1
RTS  (via drill 0.35)
  Top 0.305: IC5.24 17.54,61.97 v18.31,61.2
  Top 0.406: R16.2 10.76,56.76 v12.6,56.76
  Top 0.61: R16.2 8.23,56.69 T2.E
  Bottom 0.406: v12.6,56.76 14.5,58.66 17.04,58.66 18.31,59.93 v18.31,61.2
RXD
  Top 0.305: IC5.25 20.54,62.47 R14.2
RXD0  (via drill 0.35)
  Top 0.305: S2.2 40.42,73.9 41.38,74.87 43.5,74.87 44.47,73.9 v46.25,73.9
  Top 0.61: v75.21,84.82 73.39,84.82 U1.34
  Top 0.813: R13.1 25.93,63.55 v25.93,65.01 | v31.01,73.9 S2.2
  Bottom 0.305: v46.25,73.9 57.17,84.82 v75.21,84.82
  Bottom 0.813: v25.93,65.01 25.93,68.82 v31.01,73.9
TXD
  Top 0.305: IC5.26 22.2,62.97 R13.2
TXD0  (via drill 0.35)
  Top 0.305: S2.3 40.42,71.36 41.38,72.33 43.5,72.33 44.47,71.36 v46.25,71.36
  Top 0.61: U1.35 76.59,85.98 78,84.57 v78,81.52
  Top 0.813: S2.3 v31.01,71.36 | v27.2,62.47 24.92,60.19 R14.1
  Bottom 0.406: v78,81.52 70.38,81.52 64.03,75.17 50.06,75.17 v46.25,71.36
  Bottom 0.813: v31.01,71.36 27.2,67.55 v27.2,62.47
VBUS  (via drill 0.35)
  Top 0.305: IC5.8 11.8,64.38 v9.93,64.38
  Top 0.61: v6.88,75.17 7.2,75.49 R8.2
  Top 0.813: R8.2 12.91,75.49 14.5,73.9 16.72,73.9 R7.1
  Bottom 0.61: v9.93,64.38 6.88,67.42 v6.88,75.17
VIN5V  (via drill 0.35)
  Top 0.61: S1.8 R7.2 17.28,76.36 D1.A | IC3.8 22.55,90.62 22.34,90.41 | C3.2 41.68,85.84 v41.17,85.33 | v36.09,84.06 35.63,84.06 IC3.4
  Top 0.813: D1.A v19.58,78.98 | v19.58,84.06 22.34,86.82 22.34,90.41 LED2.A LED1.A
  Bottom 0.61: v41.17,85.33 39.9,84.06 v36.09,84.06 33.55,81.52 22.12,81.52 v19.58,84.06
  Bottom 0.813: v19.58,78.98 v19.58,84.06